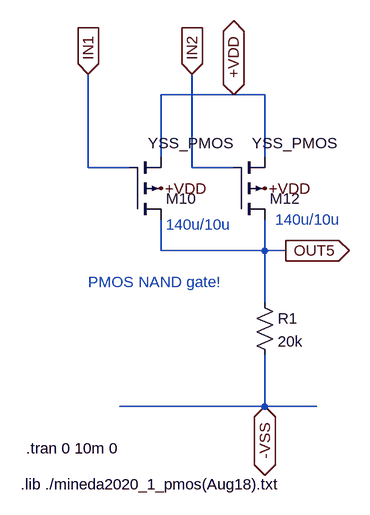
[diagram p0: schematic PMOS-NOR.asc]
PMOS-NOR.asc, the LTspice schematic file:
Version 4
SHEET 1 2296 2968
WIRE 976 -912 864 -912
WIRE 1024 -912 976 -912
WIRE 864 -816 864 -912
WIRE 1024 -816 1024 -912
WIRE 752 -800 752 -944
WIRE 816 -800 752 -800
WIRE 912 -800 912 -944
WIRE 976 -800 912 -800
WIRE 864 -672 864 -720
WIRE 1024 -672 1024 -720
WIRE 1024 -672 864 -672
WIRE 1056 -672 1024 -672
WIRE 1024 -592 1024 -672
WIRE 1024 -432 1024 -512
WIRE 1024 -432 800 -432
WIRE 1104 -432 1024 -432
FLAG 1024 -432 -VSS
IOPIN 1024 -432 BiDir
FLAG 1056 -672 OUT5
IOPIN 1056 -672 Out
FLAG 864 -768 +VDD
FLAG 1024 -768 +VDD
FLAG 912 -944 IN2
IOPIN 912 -944 In
FLAG 752 -944 IN1
IOPIN 752 -944 In
FLAG 976 -912 +VDD
IOPIN 976 -912 BiDir
SYMBOL pmos4 816 -720 M180
WINDOW 3 28 118 Left 2
SYMATTR Value YSS_PMOS
SYMATTR InstName M10
SYMATTR Value2 l=10u w=140u ad=0.994n as=0.994n pd=98u ps=98u
SYMBOL pmos4 976 -720 M180
WINDOW 3 28 118 Left 2
SYMATTR Value YSS_PMOS
SYMATTR InstName M12
SYMATTR Value2 l=10u w=140u ad=0.994n as=0.994n pd=98u ps=98u
SYMBOL res 1008 -608 R0
SYMATTR InstName R1
SYMATTR Value 20k
TEXT 648 -312 Left 2 !.lib ./mineda2020_1_pmos(Aug18).txt
TEXT 656 -368 Left 2 !.tran 0 10m 0
TEXT 1040 -720 Left 2 ;140u/10u
TEXT 872 -712 Left 2 ;140u/10u
TEXT 752 -624 Left 2 ;PMOS NAND gate!

The netlist it stands for:
* PMOS-NOR.asc
M10 OUT5 IN1 +VDD +VDD YSS_PMOS l=10u w=140u ad=0.994n as=0.994n pd=98u ps=98u
M12 OUT5 IN2 +VDD +VDD YSS_PMOS l=10u w=140u ad=0.994n as=0.994n pd=98u ps=98u
R1 OUT5 -VSS 20k
.model NMOS NMOS
.model PMOS PMOS
.lib standard.mos
.lib ./mineda2020_1_pmos(Aug18).txt
.tran 0 10m 0
* 140u/10u
* 140u/10u
* PMOS NAND gate!
.backanno
.end